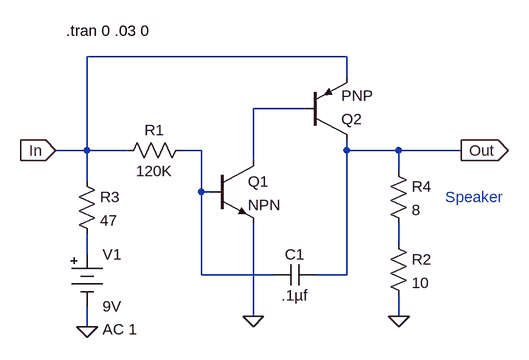
[diagram p0: schematic lab00-test.asc]
lab00-test.asc, the LTspice schematic file:
Version 4
SHEET 1 880 680
WIRE 336 -48 -64 -48
WIRE 336 -16 336 -48
WIRE 272 32 192 32
WIRE -64 96 -64 -48
WIRE -64 96 -112 96
WIRE 0 96 -64 96
WIRE 112 96 80 96
WIRE 336 96 336 80
WIRE 416 96 336 96
WIRE 512 96 416 96
WIRE 192 112 192 32
WIRE 416 128 416 96
WIRE -64 144 -64 96
WIRE 112 160 112 96
WIRE 128 160 112 160
WIRE 416 240 416 208
WIRE -64 256 -64 224
WIRE 112 288 112 160
WIRE 224 288 112 288
WIRE 336 288 336 96
WIRE 336 288 288 288
WIRE 192 352 192 208
WIRE 416 352 416 320
WIRE -64 368 -64 336
FLAG -64 368 0
FLAG 192 352 0
FLAG 416 352 0
FLAG 512 96 Out
IOPIN 512 96 Out
FLAG -112 96 In
IOPIN -112 96 In
SYMBOL npn 128 112 R0
SYMATTR InstName Q1
SYMBOL pnp 272 80 M180
SYMATTR InstName Q2
SYMBOL res -16 112 R270
WINDOW 0 32 56 VTop 0
WINDOW 3 0 56 VBottom 0
SYMATTR InstName R1
SYMATTR Value 120K
SYMBOL res 400 224 R0
SYMATTR InstName R2
SYMATTR Value 10
SYMBOL res -80 128 R0
SYMATTR InstName R3
SYMATTR Value 47
SYMBOL cap 224 304 R270
WINDOW 0 32 32 VTop 0
WINDOW 3 0 32 VBottom 0
SYMATTR InstName C1
SYMATTR Value .1µf
SYMBOL res 400 112 R0
SYMATTR InstName R4
SYMATTR Value 8
SYMBOL Misc\\battery -64 240 R0
WINDOW 123 24 132 Left 0
WINDOW 39 0 0 Left 0
SYMATTR Value2 AC 1
SYMATTR InstName V1
SYMATTR Value 9V
TEXT 488 168 Left 0 ;Speaker
TEXT -96 -88 Left 0 !.tran 0 .03 0

The netlist it stands for:
* lab00-test.asc
Q1 N001 N002 0 0 NPN
Q2 Out N001 In 0 PNP
R1 In N002 120K
R2 N003 0 10
R3 In N004 47
C1 N002 Out .1µf
R4 Out N003 8
V1 N004 0 9V AC 1
.model NPN NPN
.model PNP PNP
.lib standard.bjt
* Speaker
.tran 0 .03 0
.backanno
.end